# Altium schematic sheet Interface_Mikrobus.SchDoc: drive_motor
size Letter; ApprovedBy: himself; Author: Arthur Bou-Boinne; Organization: Cegep Limoilou; Address1: 1300, 8e Avenue; Address2: Québec, QC; Address3: Canada; Address4: G1J 5L5; SheetNumber: 3; SheetTotal: 4
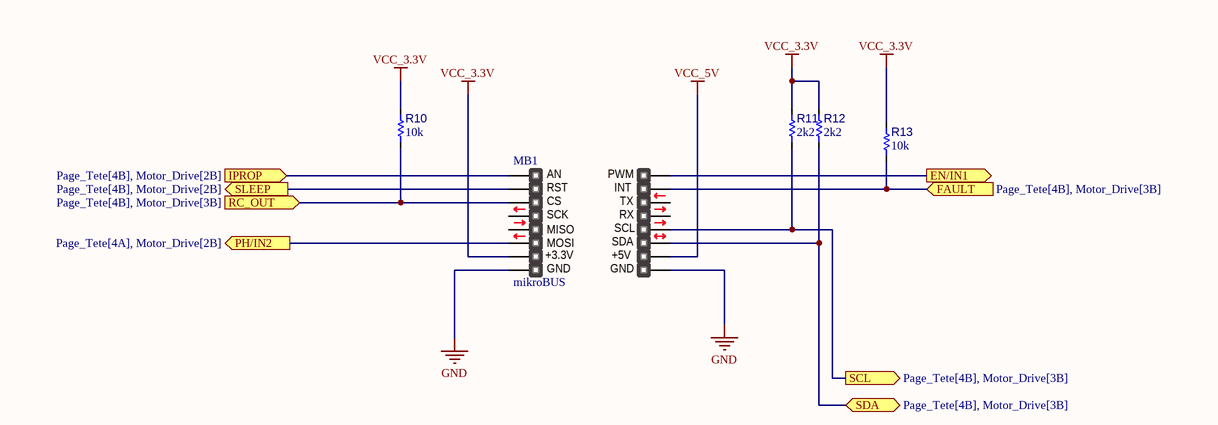
[diagram p0: Interface_Mikrobus.SchDoc]

## Parts
MB1  mikroBUS  [mikroBUS - Large]  (no BOM)
R10  value 10k  [R_1005[0402]]  (hidden comment: Res 10k 1% 0402)
R11  value 2k2  [R_1005[0402]]  (hidden comment: Res 2k2 1% 0402)
R12  value 2k2  [R_1005[0402]]  (hidden comment: Res 2k2 1% 0402)
R13  value 10k  [R_1005[0402]]  (hidden comment: Res 10k 1% 0402)

## Ports
EN/IN1 (out, see Page_Tete[4A], Motor_Drive[2B]), FAULT (in, see Page_Tete[4B], Motor_Drive[3B]), IPROP (in, see Page_Tete[4B], Motor_Drive[2B]), PH/IN2 (out, see Page_Tete[4A], Motor_Drive[2B]), RC_OUT (in, see Page_Tete[4B], Motor_Drive[3B]), SCL (out, see Page_Tete[4B], Motor_Drive[3B]), SDA (bidir, see Page_Tete[4B], Motor_Drive[3B]), SLEEP (out, see Page_Tete[4B], Motor_Drive[2B])

## Nets
GND: MB1.8(GND) MB1.9(GND)
VCC_3.3V: MB1.7(3.3V) R10.2 R11.2 R12.2 R13.2
VCC_5V: MB1.10(5V)
EN/IN1: MB1.16(PWM) ; port EN/IN1
FAULT: MB1.15(INT) R13.1 ; port FAULT
IPROP: MB1.1(AN) ; port IPROP
PH/IN2: MB1.6(MOSI) ; port PH/IN2
RC_OUT: MB1.3(CS) R10.1 ; port RC_OUT
SCL: MB1.12(SCL) R11.1 ; port SCL
SDA: MB1.11(SDA) R12.1 ; port SDA
SLEEP: MB1.2(RST) ; port SLEEP

Not connected (* = marked no-connect by the designer): MB1 4(SCK) 5(MISO) 13(TX) 14(RX)

## Notes on the sheet
- Titre :
- Conception :
- Date :
- Approbation :
- Heure :
- Révision :
- Feuille
- de
- Fichier :
- (in symbol mikroBUS compatible add-on board) +3.3V; +5V

## Library data of the parts
MB1 = mikroBUS compatible add-on board
R10 R13 = RES003: Resistor type 1; Manufacturer 1: Yageo; Manufacturer Part Number 1: RC0402FR-0710KL; LibRef: RES003; Puissance: 1/16W; Max Working Voltage: 50V; Tolerance: 1%; Mounting Technology: SMT; Supplier 1: LCSC; Supplier Part Number 1: C60490
R11 R12 = RES008: Resistor type 1; Manufacturer 1: Yageo; Manufacturer Part Number 1: RC0402FR-072K2L; LibRef: RES008; Code CEGEP: RES2.2KSM; Puissance: 1/16W; Max Working Voltage: 50V; Tolerance: 1%; Mounting Technology: SMT; Supplier 1: LCSC; Supplier Part Number 1: C114762; Supplier 2: Digi-Key; Supplier Part Number 2: 311-2.20KLRCT-ND